# Altium project Range_RearSide.PrjPcb
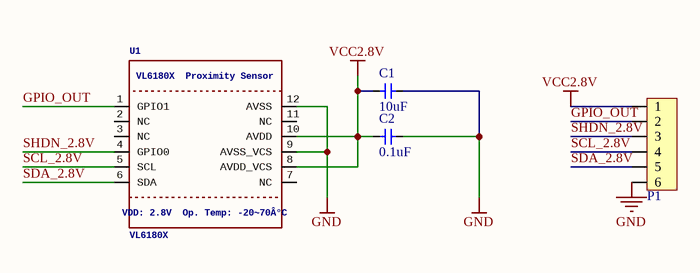
[diagram p0: Range_RearSide.SchDoc]
1 sheet, 4 parts. Net scope: global (net labels, ports and power ports of the same name join across sheets).
Board file: Range_RearSide.PcbDoc

## Sheet Range_RearSide.SchDoc
size A

### Parts
C1  value 10uF  [CAP_0805]  (hidden comment: Cap_0805)
C2  value 0.1uF  [CAP_0603]  (hidden comment: Cap_0603)
P1  HDR1x6_1.27  [HDR1X6_1.27_180H_SMD]  (value not drawn)
U1  VL6180X  VL6180X
ProximitySensor: VL6180X / Proximity Sensor  VDD:2.8V
Op.Temp:-20~70Â°C: VDD: 2.8V / Op. Temp: -20~70Â°C  [LGA12_ST_4.8X2.8X1MM]

### Nets
GND: C1.1 C2.1 P1.6 U1.9(AVSS_VCS) U1.12(AVSS)
VCC2.8V: C1.2 C2.2 P1.1 U1.8(AVDD_VCS) U1.10(AVDD)
GPIO_OUT: P1.2 U1.1(GPIO1)
SCL_2.8V: P1.4 U1.5(SCL)
SDA_2.8V: P1.5 U1.6(SDA)
SHDN_2.8V: P1.3 U1.4(GPIO0)

Not connected (* = marked no-connect by the designer): U1 2(NC) 3(NC) 7(NC) 11(NC)

### Library data of the parts
C1 = Cap_0805: Capacitor
C2 = Cap_0603: Capacitor
P1 = HDR1x6_1.27: Header
U1 = VL6180X: VL6180x Proximity and Light Sensor with Gesture Recognition    Supply Level: 2.8V (3.0V Max!)  Range: 0-10cm  Light Sensor: 0..100K Lux (16-bit output)  IR emitter: 850 nm  I2C Address: 0x29 (7-bit)